# EAGLE design Papra v0.10 (EAGLE 9.6.2)
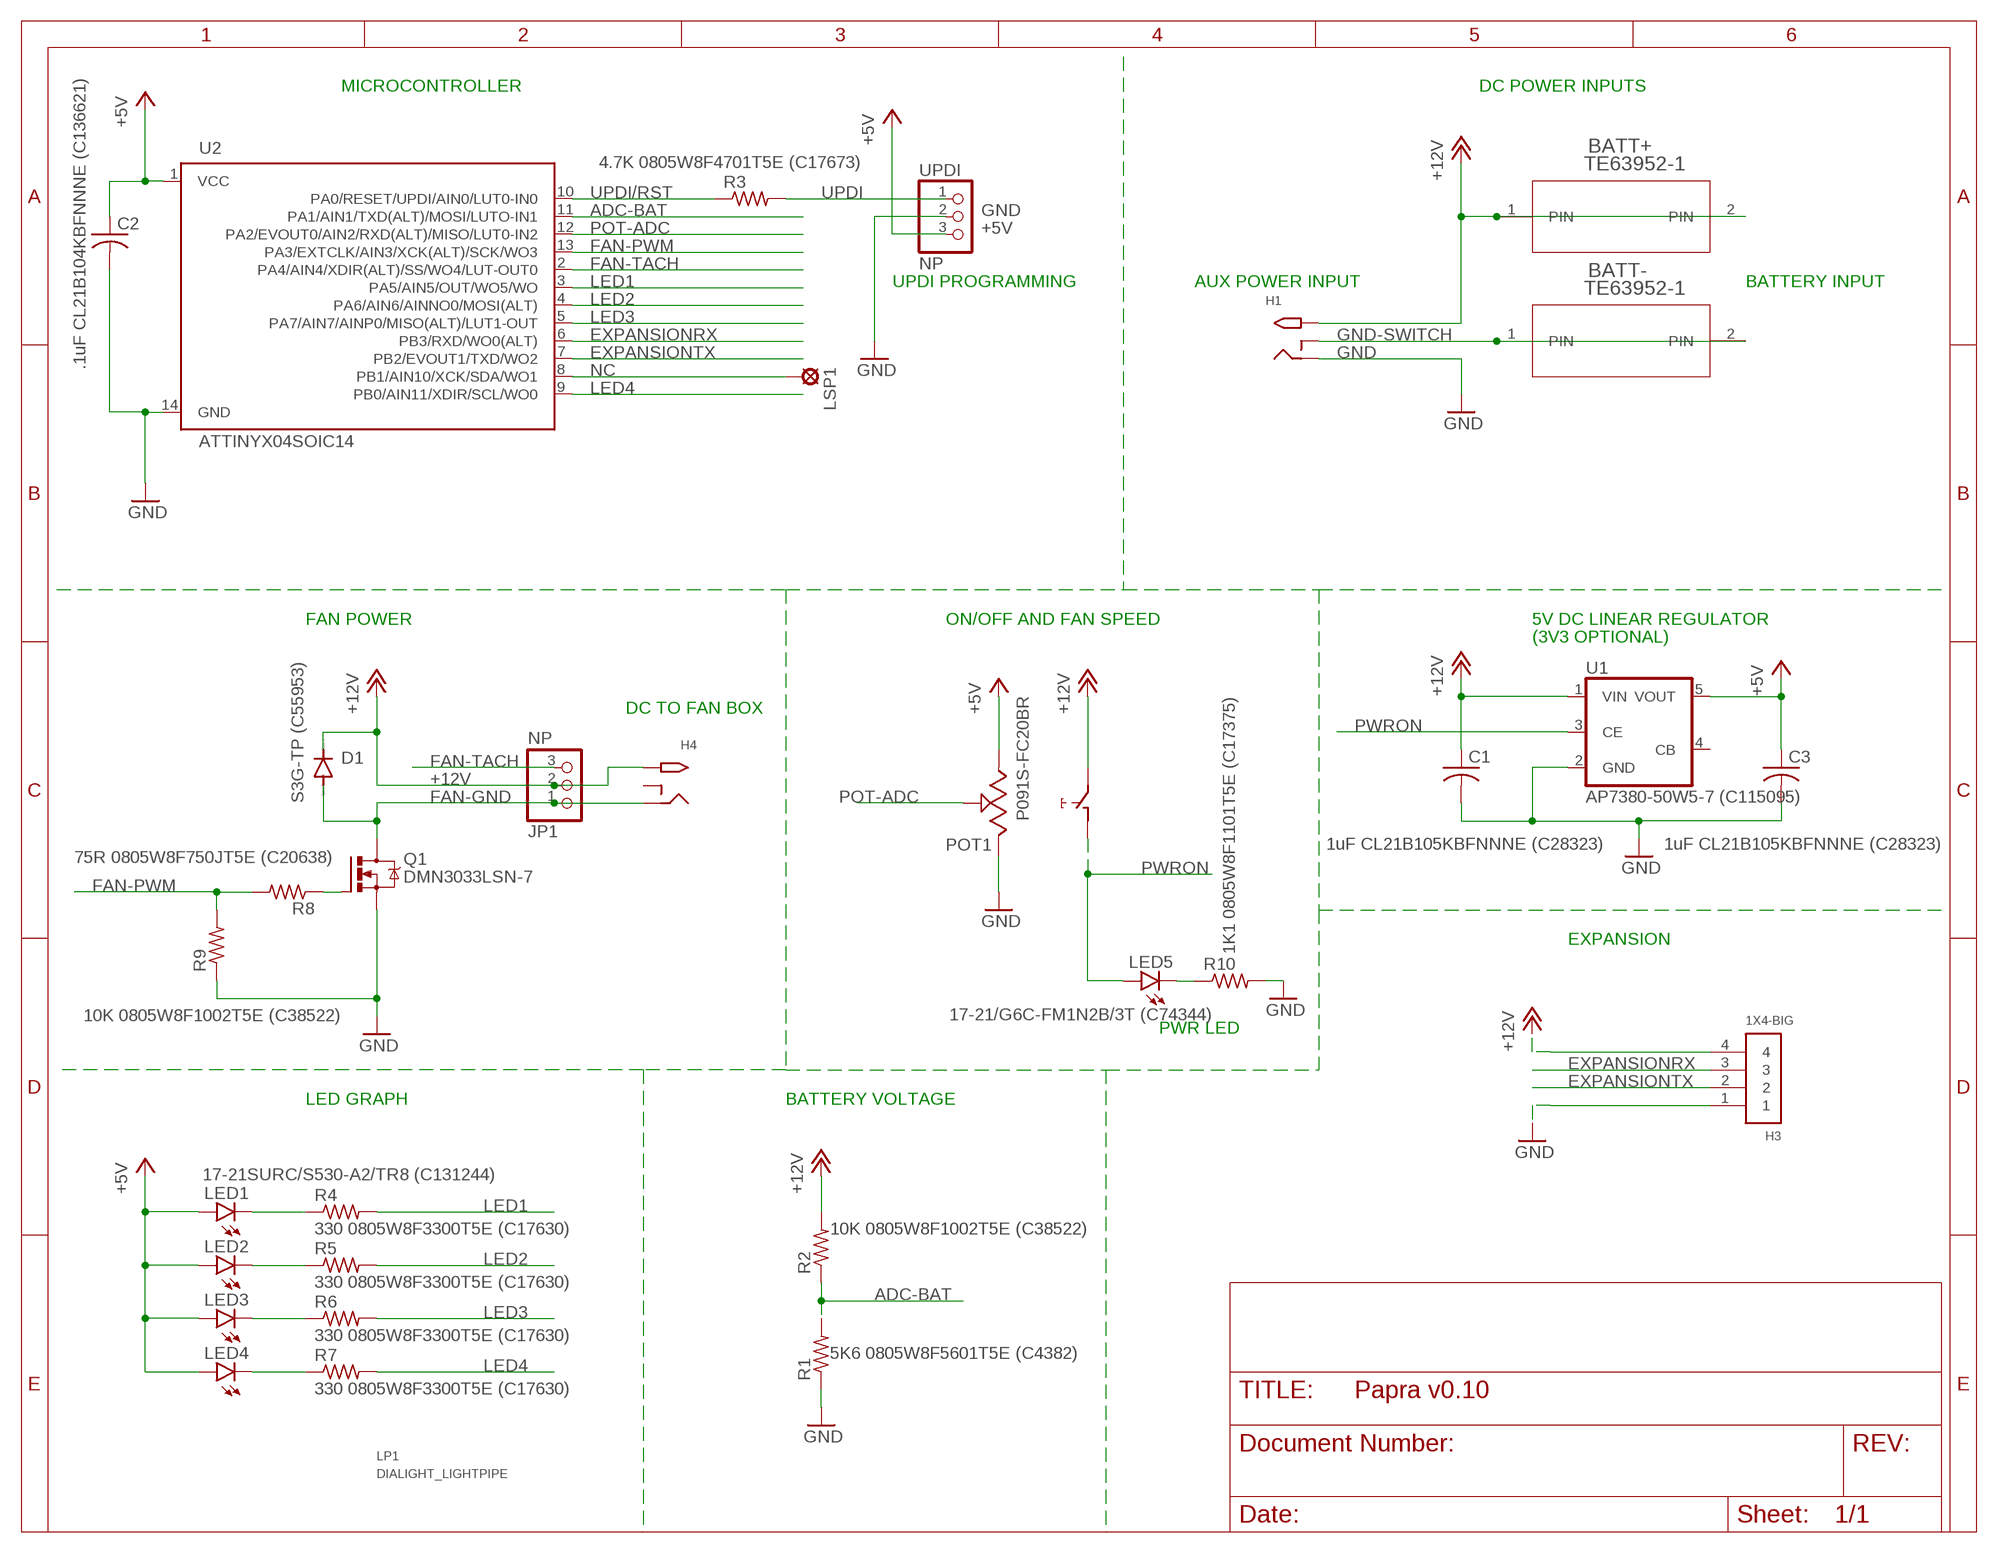
[diagram p0: schematic, sheet 1]

## Parts
BATT+  TE63952-1  [TE63952-1]
BATT-  TE63952-1  [TE63952-1]
C1  1uF CL21B105KBFNNNE (C28323)  C-USC0805  [C0805]
C2  .1uF CL21B104KBFNNNE (C136621)  C-USC0805  [C0805]
C3  1uF CL21B105KBFNNNE (C28323)  C-USC0805  [C0805]
D1  S3G-TP (C55953)  DIODE-SMC  [SMC]
H1  M-CUI-PJ-066A  PJ-066A  [DCJACK-PJ-066A]
H3  1X4-BIG  [1X04-BIG]
H4  M-CUI-PJ-066A  PJ-066A  [DCJACK-PJ-066A]
JP1  NP  PINHD-1X3  [1X03]
LED1  17-21SURC/S530-A2/TR8 (C131244)  LEDCHIPLED_0805  [CHIPLED_0805]
LED2  17-21SURC/S530-A2/TR8 (C131244)  LEDCHIPLED_0805  [CHIPLED_0805]
LED3  17-21SURC/S530-A2/TR8 (C131244)  LEDCHIPLED_0805  [CHIPLED_0805]
LED4  17-21SURC/S530-A2/TR8 (C131244)  LEDCHIPLED_0805  [CHIPLED_0805]
LED5  17-21/G6C-FM1N2B/3T (C74344)  LEDCHIPLED_0805  [CHIPLED_0805]
LP1  DIALIGHT_LIGHTPIPE  [DIALIGHT_5151020F_/LEDS]
LSP1  SE13  [SE13]
POT1  P091S-FC20BR  [P091S-FC20BR]
Q1  DMN3033LSN-7  NMOSFETSOT23  [SOT23]
R1  5K6 0805W8F5601T5E (C4382)  R-US_R0805  [R0805]
R2  10K 0805W8F1002T5E (C38522)  R-US_R0805  [R0805]
R3  4.7K 0805W8F4701T5E (C17673)  R-US_R0805  [R0805]
R4  330 0805W8F3300T5E (C17630)  R-US_R0805  [R0805]
R5  330 0805W8F3300T5E (C17630)  R-US_R0805  [R0805]
R6  330 0805W8F3300T5E (C17630)  R-US_R0805  [R0805]
R7  330 0805W8F3300T5E (C17630)  R-US_R0805  [R0805]
R8  75R 0805W8F750JT5E (C20638)  R-US_R0805  [R0805]
R9  10K 0805W8F1002T5E (C38522)  R-US_R0805  [R0805]
R10  1K1 0805W8F1101T5E (C17375)  R-US_R0805  [R0805]
U1  AP7380-50W5-7 (C115095)  TS520533  [SOT25]
U2  ATTINYX04SOIC14  [SOIC127P600X144-14]
UPDI  NP  PINHD-1X3  [1X03]

## Nets
+5V: C2.1 C3.1 LED1.A LED2.A LED3.A LED4.A POT1.1 U1.5(VOUT) U2.1(VCC) UPDI.3
+12V: BATT+.1(PIN) BATT+.2(PIN) C1.1 D1.C H1.PWR(TIP) H3.4 H4.PWR(TIP) JP1.2 POT1.NO R2.2 U1.1(VIN)
ADC-BAT: R1.2 R2.1 U2.11(PA1/AIN1/TXD(ALT)/MOSI/LUTO-IN1)
EXPANSIONRX: H3.3 U2.6(PB3/RXD/WO0(ALT))
EXPANSIONTX: H3.2 U2.7(PB2/EVOUT1/TXD/WO2)
FAN-GND: D1.A H4.GND(RING) JP1.1 Q1.3(D)
FAN-PWM: R8.2 R9.2 U2.13(PA3/EXTCLK/AIN3/XCK(ALT)/SCK/WO3)
FAN-TACH: JP1.3 U2.2(PA4/AIN4/XDIR(ALT)/SS/WO4/LUT-OUT0)
FETGATE: Q1.1(G) R8.1
GND: C1.2 C2.2 C3.2 H1.GND(RING) H3.1 POT1.3 Q1.2(S) R1.1 R9.1 R10.2 U1.2(GND) U2.14(GND) UPDI.2
GND-SWITCH: BATT-.1(PIN) BATT-.2(PIN) H1.GNDBREAK(RING_SW)
LED1: R4.2 U2.3(PA5/AIN5/OUT/WO5/WO)
LED1-R: LED1.C R4.1
LED2: R5.2 U2.4(PA6/AIN6/AINNO0/MOSI(ALT))
LED2-R: LED2.C R5.1
LED3: R6.2 U2.5(PA7/AIN7/AINP0/MISO(ALT)/LUT1-OUT)
LED3-R: LED3.C R6.1
LED4: R7.2 U2.9(PB0/AIN11/XDIR/SCL/WO0)
LED4-R: LED4.C R7.1
LED5-R: LED5.C R10.1
NC: LSP1.MP U2.8(PB1/AIN10/XCK/SDA/WO1)
POT-ADC: POT1.2 U2.12(PA2/EVOUT0/AIN2/RXD(ALT)/MISO/LUT0-IN2)
PWRON: LED5.A POT1.COM U1.3(CE)
UPDI: R3.2 UPDI.1
UPDI/RST: R3.1 U2.10(PA0/RESET/UPDI/AIN0/LUT0-IN0)
Unconnected: H4.GNDBREAK(RING_SW) U1.4(CB)

## Notes on the sheet
- MICROCONTROLLER | DC POWER INPUTS
- UPDI PROGRAMMING | AUX POWER INPUT | BATTERY INPUT
- FAN POWER | ON/OFF AND FAN SPEED | 5V DC LINEAR REGULATOR
- (3V3 OPTIONAL)
- DC TO FAN BOX
- EXPANSION
- PWR LED
- LED GRAPH | BATTERY VOLTAGE

## Library data of the parts
BATT+ BATT- = PC-LIB:TE63952-1
C1-C3 = rcl:C-US: CAPACITOR, American symbol; SPICEPREFIX: C
D1 = diode:DIODE-: DIODE
H1 H4 = PC-LIB:PJ-066A
H3 = adafruit:1X4: 4-pin connector
JP1 UPDI = adafruit:PINHD-1X3: PIN HEADER
LED1-LED5 = led:LED: LED OSRAM: - CHIPLED LG R971, LG N971, LY N971, LG Q971, LY Q971, LO R971, LY R971 LH N974, LH R974 LS Q976, LO Q976, LY Q976 LO Q996 - Hyper CHIPLED LW Q18S LB Q993, LB Q99A, LB R99A - SideLED LS A670, LO A670, LY A670, LG A670, LP A670 LB A673, LV A673, LT A673, LW A673 LH A674 LY A675 LS A676, LA A676, LO A676, LY A676, LW A676 LS A679, LY A679, LG A679 - Hyper Micro SIDELED® LS Y876, LA Y876, LO Y876, LY Y876 LT Y87S - SmartLED LW L88C, LW L88S LB L89C, LB L89S, LG L890 LS L89K, LO L89K, LY L89K LS L896, LA L896, LO L896, LY L896 - TOPLED LS T670, LO T670, LY T670, LG T670, LP T670 LSG T670, LSP T670, LSY T670, LOP T670, LYG T670 LG T671, LOG T671, LSG T671 LB T673, LV T673, LT T673, LW T673 LH T674 LS T676, LA T676, LO T676, LY T676, LB T676, LH T676, LSB T676, LW T676 LB T67C, LV T67C, LT T67C, LS T67K, LO T67K, LY T67K, LW E67C LS E67B, LA E67B, LO E67B, LY E67B, LB E67C, LV E67C, LT E67C LW T67C LS T679, LY T679, LG T679 LS T770, LO T770, LY T770, LG T770, LP T770 LB T773, LV T773, LT T773, LW T773 LH T774 LS E675, LA E675, LY E675, LS T675 LS T776, LA T776, LO T776, LY T776, LB T776 LHGB T686 LT T68C, LB T68C - Hyper Mini TOPLED® LB M676 - Mini TOPLED Santana® LG M470 LS M47K, LO M47K, LY M47K Source: http://www.osram.convergy.de LUXEON: - LUMILED® LXK2-PW12-R00, LXK2-PW12-S00, LXK2-PW14-U00, LXK2-PW14-V00 LXK2-PM12-R00, LXK2-PM12-S00, LXK2-PM14-U00 LXK2-PE12-Q00, LXK2-PE12-R00, LXK2-PE12-S00, LXK2-PE14-T00, LXK2-PE14-U00 LXK2-PB12-K00, LXK2-PB12-L00, LXK2-PB12-M00, LXK2-PB14-N00, LXK2-PB14-P00, LXK2-PB14-Q00 LXK2-PR12-L00, LXK2-PR12-M00, LXK2-PR14-Q00, LXK2-PR14-R00 LXK2-PD12-Q00, LXK2-PD12-R00, LXK2-PD12-S00 LXK2-PH12-R00, LXK2-PH12-S00 LXK2-PL12-P00, LXK2-PL12-Q00, LXK2-PL12-R00 Source: www.luxeon.com KINGBRIGHT: KA-3528ASYC Source: www.kingbright.com
LP1 = PC-LIB:DIALIGHT_LIGHTPIPE: DIALIGHT QUAD LIGHTPIPE 515-1020 WITH 0805LEDS
LSP1 = solpad:SE13: SOLDER PAD E1542, drill 1,3mm, distributor Buerklin, 07F815
POT1 = PC-LIB:P091S-FC20BR: TT P091S-FC20BR10K
Q1 = Transistor:NMOSFET: N-Channel MOSFET - Generic; CATEGORY: Transistor; SUB-CATEGORY: MOSFET; TYPE: N-Channel; VALUE: NMOSFET
R1-R10 = rcl:R-US_: RESISTOR, American symbol; SPICEPREFIX: R
U1 = v-reg:TS5205: 150mA Low Noise LDO Voltage Regulator with Enable TSC [Taiwan Semiconductor Company, Ltd] Source: http://www.taiwansemi.com .. 5205_0409c.pdf
U2 = PC-LIB:ATTINYX04

## Board
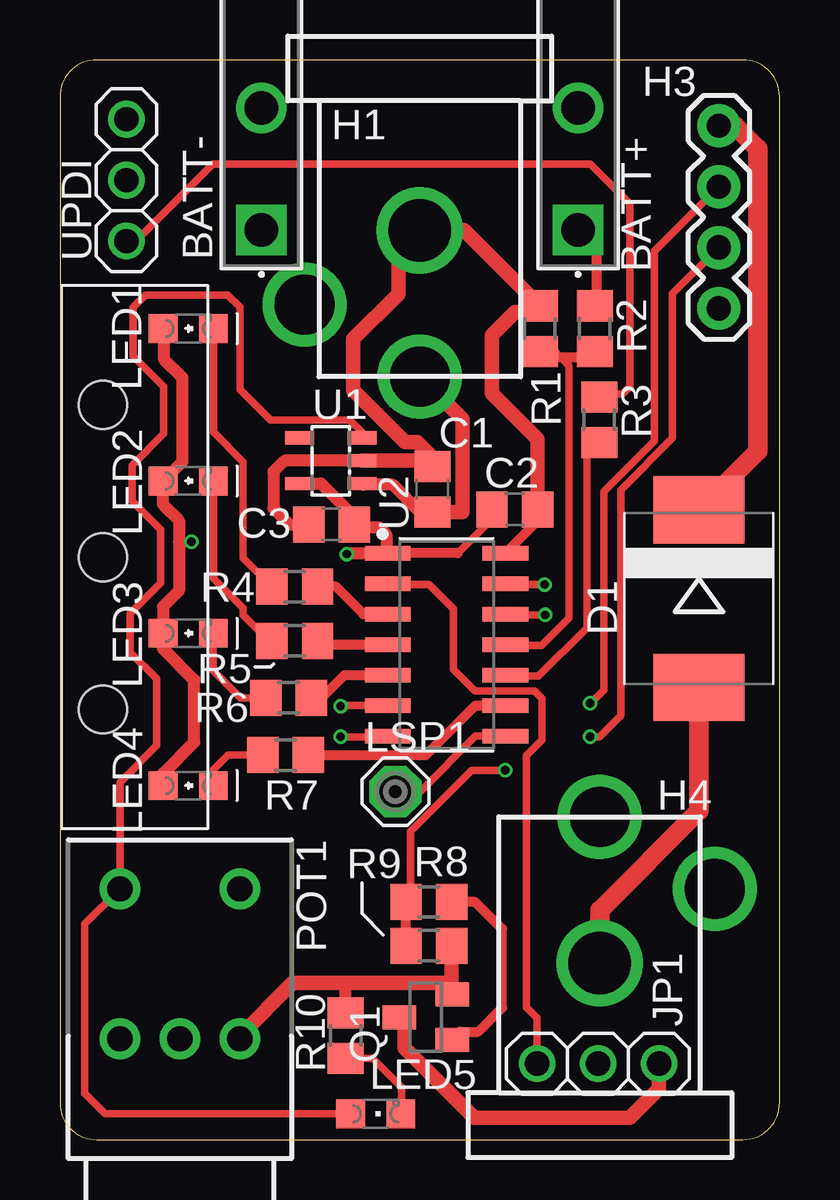
[diagram p1: board, top side]
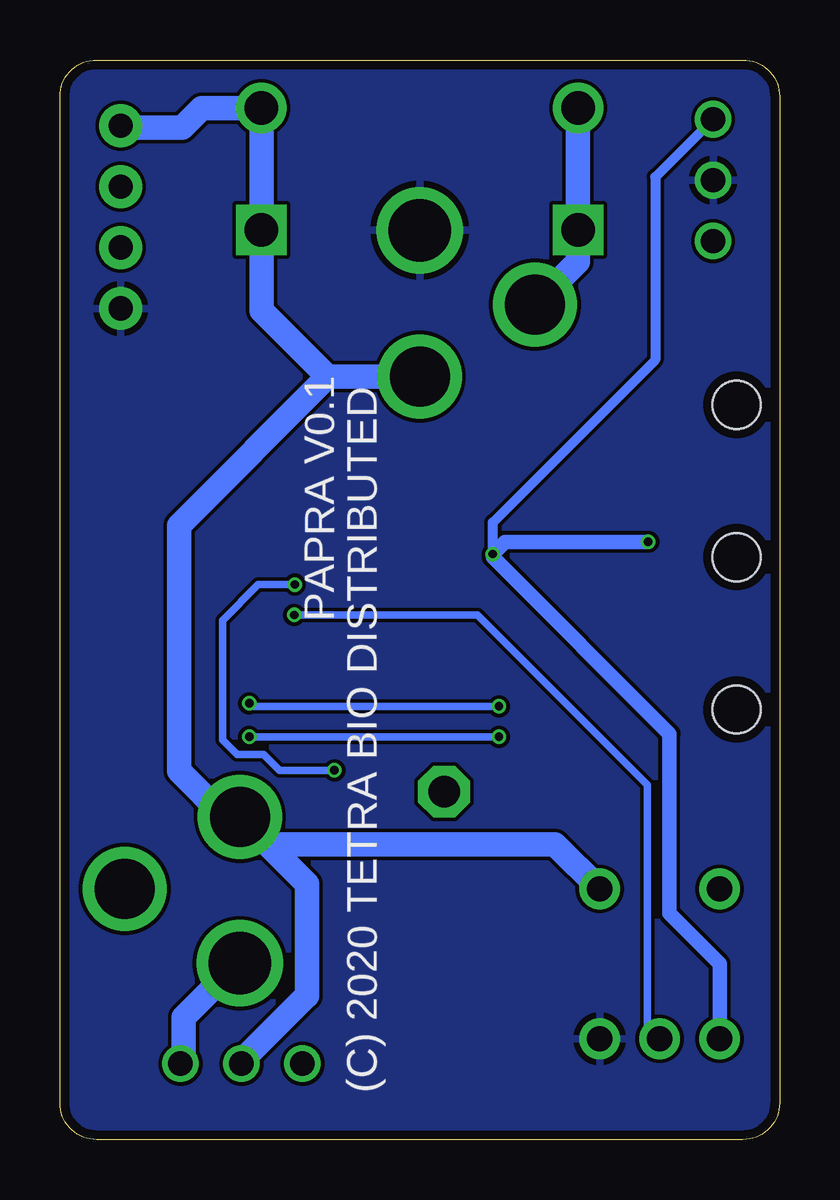
[diagram p2: board, bottom side, seen from below]

Size 30 x 45 mm. Coordinates in mm from the lower left corner, seen from the top.
Outline: 1.52,0 28.48,0 arc90 30,1.52 30,43.48 arc90 28.48,45 1.52,45 arc90 0,43.48 0,1.52 arc90 1.52,0
Copper layers (1*16): Top 0.035559375mm / dielectric 1.6mm / Bottom 0.035559375mm
Design rules "oshpark-2layer": minimum track width 6mil, minimum drill 10mil, track to track 6mil, track to pad 6mil, pad to pad 6mil, via to via 6mil, smd to smd 6mil, copper to edge 15mil, drill to drill 6mil, minimum pad ring 5mil, minimum via ring 5mil, stop-mask expansion 2.5mil, vias tented up to drill 0mil, thermal gap 10mil

### Footprints (pad centres in the part's own frame; a part is rotated, then mirrored left to right if it is on the bottom)
TE63952-1 = drill 1.397 pad 1.905 square: 1 -2.54,0 | drill 1.397 pad 1.905: 2 2.54,0
C0805 = smd 1.3 x 1.5: 1 -0.95,0; 2 0.95,0
SMC = smd 2.8 x 3.8: A 3.7,0; C -3.7,0
DCJACK-PJ-066A = drill 2.6: GND 0,8.1 | drill 2.5: GNDBREAK 4.8,11.2; PWR 0,14.2
1X04-BIG = drill 1.016 pad 1.778: 1 0,0; 2 2.54,0; 3 5.08,0; 4 7.62,0
1X03 = drill 1.016: 1 -2.54,0; 2 0,0; 3 2.54,0
CHIPLED_0805 = smd 1.2 x 1.2: A 0,-1.05; C 0,1.05
DIALIGHT_5151020F_/LEDS = hole 2: 0,0; 6.35,0; -6.35,0
SE13 = drill 1.321 pad 2.159 octagon: MP 0,0
P091S-FC20BR = drill 1.05 pad 1.7: 1 -5,-2.5; 2 -5,0; 3 -5,2.5; COM -11.25,-2.5; NO -11.25,2.5
SOT23 = smd 1 x 1.4: 1 -0.95,-1.1; 2 0.95,-1.1; 3 0,1.1
R0805 = smd 1.3 x 1.5: 1 -0.95,0; 2 0.95,0
SOT25 = smd 0.55 x 1.2: 1 -0.95,-1.3; 2 0,-1.3; 3 0.95,-1.3; 4 0.95,1.3; 5 -0.95,1.3
SOIC127P600X144-14 = smd 1.901 x 0.599: 1 -2.455,3.81; 2 -2.455,2.54; 3 -2.455,1.27; 4 -2.455,0; 5 -2.455,-1.27; 6 -2.455,-2.54; 7 -2.455,-3.81; 8 2.455,-3.81; 9 2.455,-2.54; 10 2.455,-1.27; 11 2.455,0; 12 2.455,1.27; 13 2.455,2.54; 14 2.455,3.81

### Placement (x,y rotation side)
BATT+  21.6,40.46 90 top
BATT-  8.4,40.46 90 top
C1  15.53,27.11 90 top
C2  18.96,26.27 0 top
C3  11.32,25.64 180 top
D1  26.64,22.55 270 top
H1  15,46 180 top
H3  27.47,34.64 90 top
H4  22.5,-0.75 0 top
JP1  22.43,3.16 180 top
LED1  5.35,33.8 270 top
LED2  5.35,27.45 270 top
LED3  5.35,21.1 270 top
LED4  5.35,14.75 270 top
LED5  13.16,1.07 270 top
LP1  1.79,24.28 270 top
LSP1  13.98,14.5 0 top
POT1  5,-0.8 270 top
Q1  15.25,5.1 90 top
R1  20,33.8 270 top
R2  22.3,33.8 90 top
R3  22.49,30 90 top
R4  9.79,23.04 0 top
R5  9.79,20.79 0 top
R6  9.53,18.41 0 top
R7  9.41,16.03 0 top
R8  15.38,9.91 180 top
R9  15.38,8.08 180 top
R10  11.92,4.33 90 top
U1  11.29,28.3 90 top
U2  16.12,20.63 0 top
UPDI  2.77,39.99 90 top

### Tracks (layer width: path | path; a pad name or v marks a point on that pad's centre or on a via)
+5V  (via drill 0.35)
  Top 0.305: C2.1 18.01,25.87 16.59,24.44 | LED1.A 4.33,33.77 | 4.33,26.44 4.3,26.47
  Top 0.406: 16.59,24.44 U2.1 | 4.97,24.91 v5.47,24.91
  Top 0.508: U1.5 10.88,27.35 12.27,25.95 C3.1 12.4,25.52 13.29,25.52 13.61,25.2 13.61,24.5 U2.1 11.99,24.44 v11.95,24.41 | 4.33,26.44 4.97,25.8 4.97,24.91 4.97,22.88 4.3,22.21 LED3.A 4.3,20.47 5.6,19.16 5.6,16.57 4.3,15.26 LED4.A | 4.33,33.77 4.33,32.53 5.09,31.77 5.09,28.25 LED2.A 4.3,26.47
  Bottom 0.406: 2.52,42.53 UPDI.3 5.18,40.12 5.18,32.5 11.95,25.73 v11.95,24.41
  Bottom 0.61: v5.47,24.91 11.44,24.91 v11.95,24.41 11.95,24.28 4.59,16.91 4.59,9.42 2.5,7.33 POT1.1
+12V
  Top 0.406: R2.2 22.36,34.81 22.36,37.16 BATT+.1 | 28.13,42.26 H3.4
  Top 0.508: C1.1 15.02,26.16 13.88,27.3 12.64,27.3 U1.1
  Top 0.61: H1.PWR 16.78,30.02 16.78,26.16 C1.1
  Top 0.813: D1.C 29.1,28.71 29.1,41.3 28.13,42.26
  Bottom 1.016: H3.4 27.39,42.19 24.91,42.19 24.09,43 BATT+.2 BATT+.1 21.6,34.56 18.84,31.8 | H1.PWR 18.84,31.8 | H4.PWR 23.13,13.45 25.04,15.36 25.04,25.6 18.84,31.8 | JP1.2 22.43,3.29 19.73,5.99 19.7,5.99 19.7,10.65 H4.PWR | POT1.NO 9.36,12.31 21.36,12.31 H4.PWR
ADC-BAT
  Top 0.305: R1.2 20.63,32.85 21.22,32.26 21.22,21.74 20.08,20.59 18.61,20.59 U2.11
  Top 0.406: R1.2 20.25,32.6 22.05,32.6 R2.1
EXPANSIONRX  (via drill 0.35)
  Top 0.305: H3.3 24.78,37.03 24.78,29.12 22.67,27.01 22.67,18.74 v22.11,18.18 | v11.7,18.05 11.73,18.09 U2.6
  Bottom 0.305: v22.11,18.18 21.98,18.05 v11.7,18.05
EXPANSIONTX  (via drill 0.35)
  Top 0.305: H3.2 25.54,35.25 25.54,29.23 23.38,27.07 23.38,17.67 22.49,16.79 v22.11,16.79 | v11.7,16.79 13.63,16.79 U2.7
  Bottom 0.305: v22.11,16.79 v11.7,16.79
FAN-GND
  Top 0.61: JP1.1 24.97,2.12 23.76,0.91 17.29,0.91 14.37,3.83 14.37,4.89 Q1.3
  Top 0.813: D1.A 26.64,13.69 22.5,9.55 H4.GND
  Bottom 1.016: H4.GND 22.6,7.35 24.84,5.1 24.84,3.29 JP1.1
FAN-PWM  (via drill 0.35)
  Top 0.305: R8.2 14.62,10.09 14.62,12.85 17.16,15.39 v18.56,15.39 | v20.21,23.14 18.61,23.14 U2.13
  Top 0.406: R9.2 R8.2
  Bottom 0.305: v18.56,15.39 20.84,15.39 21.5,16.05 22.62,16.05 23.23,16.66 23.23,21.64 21.73,23.14 v20.21,23.14
FAN-TACH
  Top 0.305: JP1.3 19.89,5.06 19.45,5.51 19.45,16.01 20.09,16.65 20.09,18.39 19.78,18.69 17.31,18.69 16.4,19.6 16.4,22.12 15.38,23.14 13.7,23.14 U2.2
FETGATE
  Top 0.305: Q1.1 16.69,4.49
  Top 0.406: 16.69,4.49 17.44,4.49 18.43,5.48 18.43,8.78 17.31,9.91 R8.1
GND
  Top 0.406: R9.1 16.57,7.85 | 19.74,34.49 R1.1 | C2.2 19.91,25.78 U2.14
  Top 0.508: U1.2 9.37,28.3 8.9,27.83 8.9,26.31 9.57,25.64 C3.2 | R10.2 11.92,6.48 11.95,6.52
  Top 0.61: U1.2 12.6,28.31 15.27,28.31 C1.2 15.53,28.44 14.89,29.07 14.38,29.07 12.22,31.23 12.22,33.36 14.11,35.24 14.11,37.01 H1.GND 16.85,37.9 R1.1 | POT1.3 7.5,4.33 9.69,6.52 11.95,6.52 16.31,6.52 16.31,6.09 | 19.74,34.49 18.98,34.49 18.01,33.52 18.01,31.09 19.91,29.19 C2.2 | Q1.2 16.31,6.09 | R9.1 16.33,6.11 16.31,6.09
  pour Bottom: 31,46.5 -1,46.5 -1,-1.5 31,-1.5
GND-SWITCH
  Bottom 1.016: BATT-.2 BATT-.1 8.4,36.6 H1.GNDBREAK
LED1
  Top 0.406: U2.3 12.65,21.9 11.51,23.04 R4.2
LED1-R
  Top 0.305: LED1.C 6.4,29.48 7.63,28.25 7.63,24.25 R4.1
LED2
  Top 0.406: R5.2 10.74,20.63 U2.4
LED2-R
  Top 0.305: LED2.C 6.4,23.39 7.63,22.15 7.63,21.86 8.71,20.79 R5.1
LED3
  Top 0.406: U2.5 11.86,19.36 10.91,18.41 R6.2
LED3-R
  Top 0.305: R6.1 7.54,18.41 6.39,19.55 6.39,21.09 LED3.C
LED4
  Top 0.406: R7.2 15.26,16.03 17.32,18.09 U2.9
LED4-R
  Top 0.305: R7.1 7.89,16.03 7.66,16.03 7,16.03 6.4,15.42 LED4.C
LED5-R
  Top 0.305: R10.1 13.04,3.38 14.24,2.18 14.24,1.1 LED5.C
NC
  Top 0.305: U2.8 17.32,16.82 15,14.5 LSP1.MP
POT-ADC  (via drill 0.35)
  Top 0.305: v20.23,21.86 18.84,21.86 18.84,21.9 U2.12
  Bottom 0.305: POT1.2 5.51,4.71 5.51,14.79 12.59,21.86 v20.23,21.86 20.33,21.86
PWRON
  Top 0.305: U1.3 12.59,29.48 12.08,29.99 8.77,30 7.51,31.26 7.51,34.69 7,35.2 3.57,35.2 3.06,34.69 3.06,32.66 4.33,31.39 4.33,29.43 3.01,28.1 3.01,26.62 4.19,25.43 4.21,23.21 2.94,21.93 2.94,20.3 4.02,19.21 4.02,16.42 2.5,14.89 POT1.COM 1.03,8.98 1.03,1.93 1.88,1.07 LED5.A
UPDI
  Top 0.305: R3.2 22.61,31.07 23.45,31.07 23.76,31.39 23.76,39.01 22.11,40.66 6.36,40.66 3.15,37.45 UPDI.1
UPDI/RST
  Top 0.305: U2.10 18.61,19.32 19.95,19.32 21.96,21.33 21.96,28.52 R3.1

### Text on the board
bPlace: (C) 2020 TETRA BIO DISTRIBUTED | PAPRA V0.1